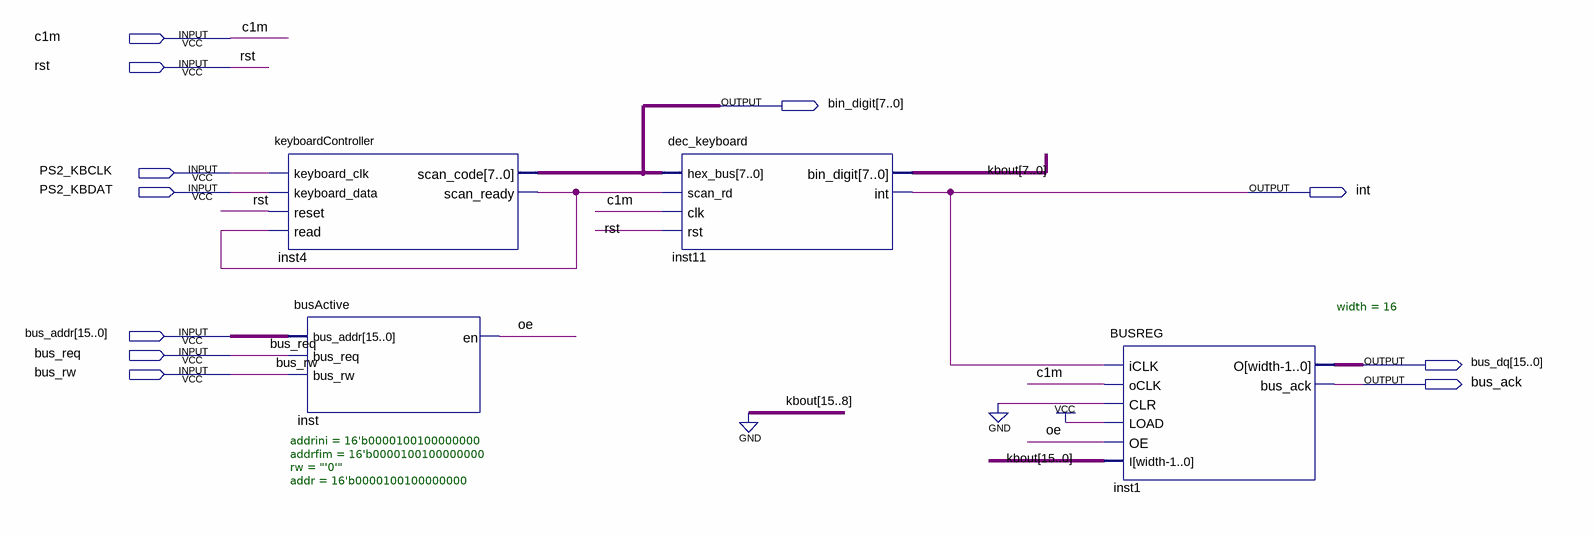
[diagram p0: schematic sheet]
// Quartus schematic Keyboard.bdf as structural Verilog: 4 symbols, 11 pins
module Keyboard (
  input  c1m,
  input  rst,
  input  PS2_KBCLK,
  input  PS2_KBDAT,
  input  [15:0] bus_addr,
  input  bus_req,
  input  bus_rw,
  output [7:0] bin_digit,
  output \int ,
  output [15:0] bus_dq,
  output bus_ack
);

  wire inst4_scan_ready, oe;
  wire [7:0] kbout;

  keyboardController inst4 (
    .keyboard_clk(PS2_KBCLK), .keyboard_data(PS2_KBDAT), .reset(rst), .read(inst4_scan_ready),
    .scan_code(bin_digit), .scan_ready(inst4_scan_ready));
  busActive #(.addrini(16'b0000100100000000), .addrfim(16'b0000100100000000), .rw("'0'"), .addr(16'b0000100100000000)) inst (
    .bus_addr(bus_addr), .bus_req(bus_req), .bus_rw(bus_rw), .en(oe));
  dec_keyboard inst11 (
    .hex_bus(bin_digit), .scan_rd(inst4_scan_ready), .clk(c1m), .rst(rst), .bin_digit(kbout), .\int (\int ));
  BUSREG #(.width(16)) inst1 (
    .iCLK(\int ), .oCLK(c1m), .CLR(1'b0), .LOAD(1'b1), .OE(oe), .I({{8{1'b0}}, kbout}), .O(bus_dq),
    .bus_ack(bus_ack));
endmodule
